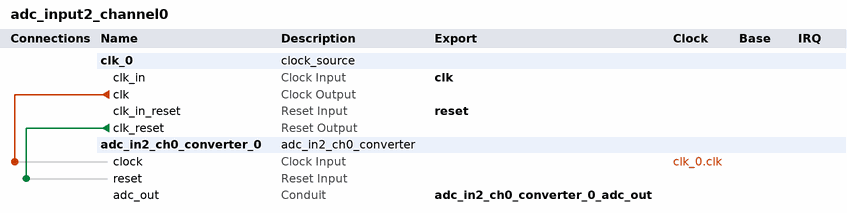
[diagram p0: system contents]
# Platform Designer (Qsys) system adc_input2_channel0, MAX 10 10M50DAF484C6GES
# Parameters at their usual value, and those the tool derives, are not listed.
package require -exact qsys 20.1
create_system adc_input2_channel0
set_project_property DEVICE_FAMILY {MAX 10}
set_project_property DEVICE 10M50DAF484C6GES

add_instance clk_0 clock_source 20.1
set_instance_parameter_value clk_0 clockFrequency 50000000

add_instance adc_in2_ch0_converter_0 adc_in2_ch0_converter 1.0

# connections
add_connection clk_0.clk adc_in2_ch0_converter_0.clock clock
add_connection clk_0.clk_reset adc_in2_ch0_converter_0.reset reset

# exported interfaces
add_interface adc_in2_ch0_converter_0_adc_out conduit end
set_interface_property adc_in2_ch0_converter_0_adc_out EXPORT_OF adc_in2_ch0_converter_0.adc_out
add_interface clk clock sink
set_interface_property clk EXPORT_OF clk_0.clk_in
add_interface reset reset sink
set_interface_property reset EXPORT_OF clk_0.clk_in_reset

set_interconnect_requirement {$system} qsys_mm.clockCrossingAdapter HANDSHAKE
set_interconnect_requirement {$system} qsys_mm.enableEccProtection FALSE
set_interconnect_requirement {$system} qsys_mm.insertDefaultSlave FALSE
set_interconnect_requirement {$system} qsys_mm.maxAdditionalLatency 1

save_system adc_input2_channel0.qsys
